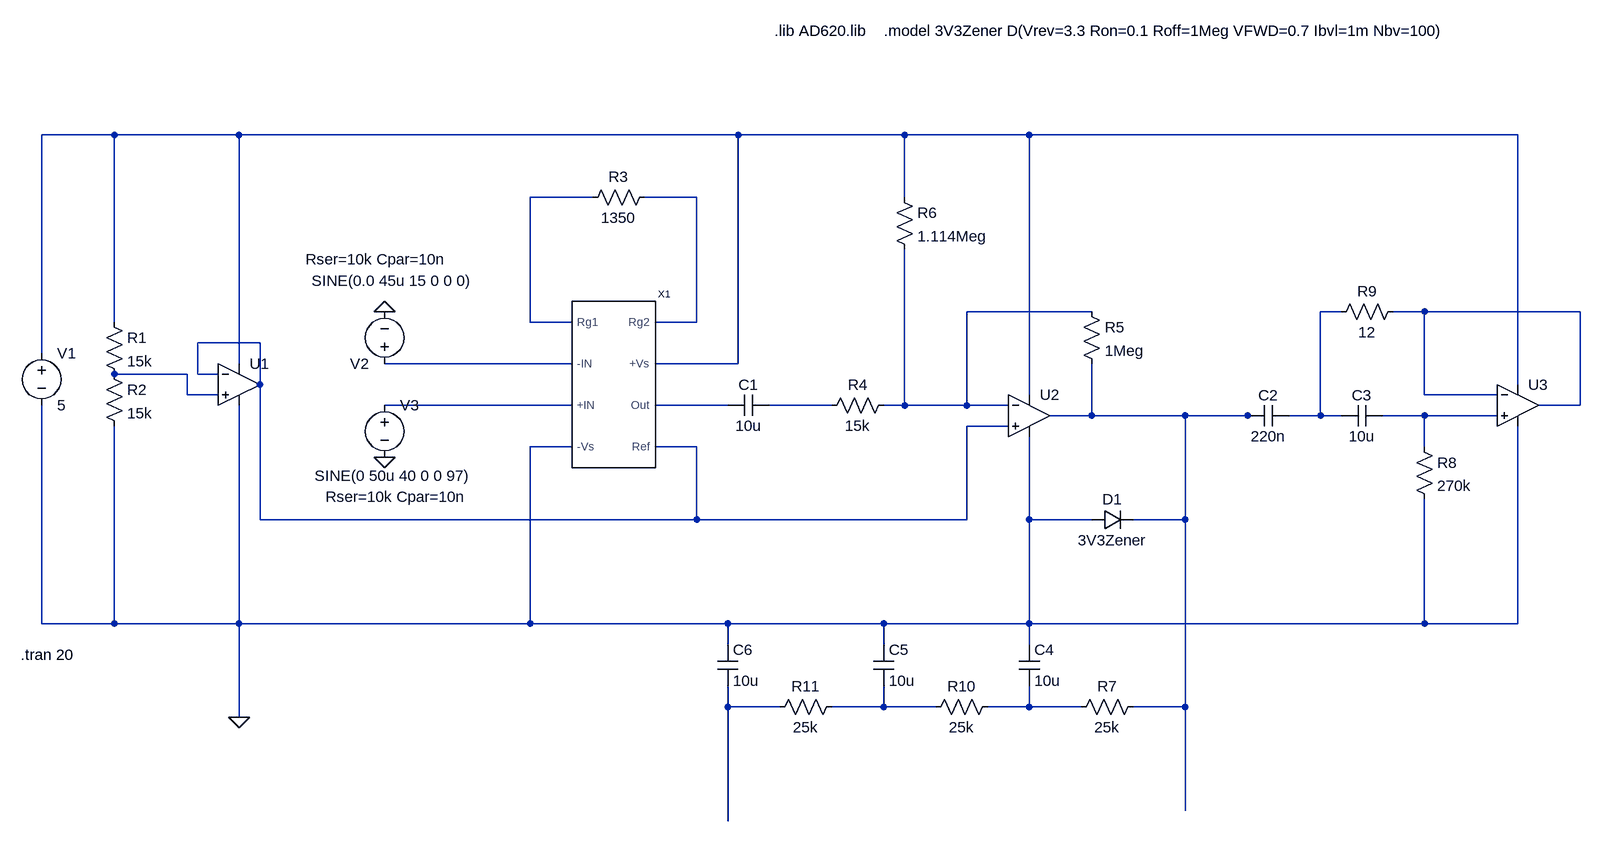
[diagram p0: schematic EEG_Differential_Into_ADC_For_Full_Scale_Range.asc]
EEG_Differential_Into_ADC_For_Full_Scale_Range.asc, the LTspice schematic file:
Version 4.1
SHEET 1 2612 820
WIRE 48 -240 -64 -240
WIRE 240 -240 48 -240
WIRE 1008 -240 240 -240
WIRE 1264 -240 1008 -240
WIRE 1456 -240 1264 -240
WIRE 2208 -240 1456 -240
WIRE 784 -144 688 -144
WIRE 944 -144 864 -144
WIRE 1264 -144 1264 -240
WIRE 1552 32 1360 32
WIRE 1936 32 1904 32
WIRE 2064 32 2016 32
WIRE 2304 32 2064 32
WIRE 48 48 48 -240
WIRE 688 48 688 -144
WIRE 752 48 688 48
WIRE 944 48 944 -144
WIRE 944 48 880 48
WIRE 272 80 176 80
WIRE -64 96 -64 -240
WIRE 240 112 240 -240
WIRE 752 112 464 112
WIRE 1008 112 1008 -240
WIRE 1008 112 880 112
WIRE 160 128 48 128
WIRE 176 128 176 80
WIRE 208 128 176 128
WIRE 272 144 272 80
WIRE 2208 144 2208 -240
WIRE 160 160 160 128
WIRE 208 160 160 160
WIRE 1456 160 1456 -240
WIRE 2064 160 2064 32
WIRE 2176 160 2064 160
WIRE 752 176 464 176
WIRE 992 176 880 176
WIRE 1152 176 1056 176
WIRE 1264 176 1264 -64
WIRE 1264 176 1232 176
WIRE 1360 176 1360 32
WIRE 1360 176 1264 176
WIRE 1424 176 1360 176
WIRE 2304 176 2304 32
WIRE 2304 176 2240 176
WIRE 1552 192 1552 112
WIRE 1552 192 1488 192
WIRE 1696 192 1552 192
WIRE 1792 192 1696 192
WIRE 1808 192 1792 192
WIRE 1904 192 1904 32
WIRE 1904 192 1856 192
WIRE 1936 192 1904 192
WIRE 2064 192 2000 192
WIRE 2176 192 2064 192
WIRE 1424 208 1360 208
WIRE 752 240 688 240
WIRE 944 240 880 240
WIRE 2064 240 2064 192
WIRE 272 352 272 144
WIRE 944 352 944 240
WIRE 944 352 272 352
WIRE 1360 352 1360 208
WIRE 1360 352 944 352
WIRE 1456 352 1456 224
WIRE 1552 352 1456 352
WIRE 1696 352 1696 192
WIRE 1696 352 1616 352
WIRE -64 512 -64 176
WIRE 48 512 48 208
WIRE 48 512 -64 512
WIRE 240 512 240 176
WIRE 240 512 48 512
WIRE 688 512 688 240
WIRE 688 512 240 512
WIRE 992 512 688 512
WIRE 1232 512 992 512
WIRE 1456 512 1456 352
WIRE 1456 512 1232 512
WIRE 2064 512 2064 320
WIRE 2064 512 1456 512
WIRE 2208 512 2208 208
WIRE 2208 512 2064 512
WIRE 992 544 992 512
WIRE 1232 544 1232 512
WIRE 1456 544 1456 512
WIRE 992 640 992 608
WIRE 1072 640 992 640
WIRE 1232 640 1232 608
WIRE 1232 640 1152 640
WIRE 1312 640 1232 640
WIRE 1456 640 1456 608
WIRE 1456 640 1392 640
WIRE 1536 640 1456 640
WIRE 1696 640 1696 352
WIRE 1696 640 1616 640
WIRE 240 656 240 512
WIRE 1696 800 1696 640
WIRE 992 816 992 640
FLAG 464 32 0
FLAG 464 256 0
FLAG 240 656 0
SYMBOL res 32 32 R0
SYMATTR InstName R1
SYMATTR Value 15k
SYMBOL res 32 112 R0
SYMATTR InstName R2
SYMATTR Value 15k
SYMBOL OpAmps\\UniversalOpAmp 240 144 R0
SYMATTR InstName U1
SYMBOL voltage -64 80 R0
WINDOW 123 0 0 Left 0
WINDOW 39 24 124 Left 2
SYMATTR InstName V1
SYMATTR Value 5
SYMBOL res 880 -160 R90
WINDOW 0 0 56 VBottom 2
WINDOW 3 32 56 VTop 2
SYMATTR InstName R3
SYMATTR Value 1350
SYMBOL res 1248 160 R90
WINDOW 0 0 56 VBottom 2
WINDOW 3 32 56 VTop 2
SYMATTR InstName R4
SYMATTR Value 15k
SYMBOL OpAmps\\UniversalOpAmp 1456 192 R0
SYMATTR InstName U2
SYMBOL res 1536 16 R0
SYMATTR InstName R5
SYMATTR Value 1Meg
SYMBOL lib\\sym\\Opamps\\AD620 816 144 R0
SYMATTR InstName X1
SYMATTR Prefix X
SYMATTR SpiceModel AD620
SYMBOL cap 1856 176 R90
WINDOW 0 0 32 VBottom 2
WINDOW 3 32 32 VTop 2
SYMATTR InstName C2
SYMATTR Value 220n
SYMBOL cap 2000 176 R90
WINDOW 0 0 32 VBottom 2
WINDOW 3 32 32 VTop 2
SYMATTR InstName C3
SYMATTR Value 10u
SYMBOL res 2048 224 R0
SYMATTR InstName R8
SYMATTR Value 270k
SYMBOL res 2032 16 R90
WINDOW 0 0 56 VBottom 2
WINDOW 3 32 56 VTop 2
SYMATTR InstName R9
SYMATTR Value 12
SYMBOL OpAmps\\UniversalOpAmp 2208 176 R0
SYMATTR InstName U3
SYMBOL voltage 464 128 R180
WINDOW 3 -135 144 Left 2
WINDOW 123 0 0 Left 0
WINDOW 39 -97 177 Left 2
SYMATTR Value SINE(0.0 45u 15 0 0 0)
SYMATTR SpiceLine Rser=10k Cpar=10n
SYMATTR InstName V2
SYMBOL voltage 464 160 R0
WINDOW 3 -108 124 Left 2
WINDOW 123 0 0 Left 0
WINDOW 39 -91 157 Left 2
SYMATTR Value SINE(0 50u 40 0 0 97)
SYMATTR SpiceLine Rser=10k Cpar=10n
SYMATTR InstName V3
SYMBOL cap 1056 160 R90
WINDOW 0 0 32 VBottom 2
WINDOW 3 32 32 VTop 2
SYMATTR InstName C1
SYMATTR Value 10u
SYMBOL res 1248 -160 R0
SYMATTR InstName R6
SYMATTR Value 1.114Meg
SYMBOL res 1632 624 R90
WINDOW 0 0 56 VBottom 2
WINDOW 3 32 56 VTop 2
SYMATTR InstName R7
SYMATTR Value 25k
SYMBOL cap 1440 544 R0
SYMATTR InstName C4
SYMATTR Value 10u
SYMBOL diode 1552 368 R270
WINDOW 0 32 32 VTop 2
WINDOW 3 0 32 VBottom 2
SYMATTR InstName D1
SYMATTR Value 3V3Zener
SYMBOL cap 1216 544 R0
SYMATTR InstName C5
SYMATTR Value 10u
SYMBOL res 1408 624 R90
WINDOW 0 0 56 VBottom 2
WINDOW 3 32 56 VTop 2
SYMATTR InstName R10
SYMATTR Value 25k
SYMBOL res 1168 624 R90
WINDOW 0 0 56 VBottom 2
WINDOW 3 32 56 VTop 2
SYMATTR InstName R11
SYMATTR Value 25k
SYMBOL cap 976 544 R0
SYMATTR InstName C6
SYMATTR Value 10u
TEXT 1064 -400 Left 2 !.lib AD620.lib
TEXT -96 560 Left 2 !.tran 20
TEXT 1232 -400 Left 2 !.model 3V3Zener D(Vrev=3.3 Ron=0.1 Roff=1Meg VFWD=0.7 Ibvl=1m Nbv=100)

The netlist it stands for:
* EEG_Differential_Into_ADC_For_Full_Scale_Range.asc
R1 N001 N009 15k
R2 N009 0 15k
X§U1 N009 N007 N001 0 N007 level1 Avol=1Meg GBW=10Meg Vos=0 En=0 Enk=0 In=0 Ink=0 Rin=500Meg  ; pins In+ In- V+ V- OUT
V1 N001 0 5
R3 N003 N002 1350
R4 N004 N012 15k
X§U2 N007 N004 N001 0 N013 level1 Avol=1Meg GBW=10Meg Vos=0 En=0 Enk=0 In=0 Ink=0 Rin=500Meg  ; pins In+ In- V+ V- OUT
R5 N004 N013 1Meg
X§X1 N010 N008 N001 0 N011 N007 N002 N003 AD620  ; pins +IN -IN +Vs -Vs Out Ref Rg1 Rg2
C2 N005 N013 220n
C3 N014 N005 10u
R8 N014 0 270k
R9 N006 N005 12
X§U3 N014 N006 N001 0 N006 level1 Avol=1Meg GBW=10Meg Vos=0 En=0 Enk=0 In=0 Ink=0 Rin=500Meg  ; pins In+ In- V+ V- OUT
V2 N008 0 SINE(0.0 45u 15 0 0 0) Rser=10k Cpar=10n
V3 N010 0 SINE(0 50u 40 0 0 97) Rser=10k Cpar=10n
C1 N012 N011 10u
R6 N001 N004 1.114Meg
R7 N013 N017 25k
C4 0 N017 10u
D1 0 N013 3V3Zener
C5 0 N016 10u
R10 N017 N016 25k
R11 N016 N015 25k
C6 0 N015 10u
.model D D
.lib standard.dio
.lib AD620.lib
.tran 20
.model 3V3Zener D(Vrev=3.3 Ron=0.1 Roff=1Meg VFWD=0.7 Ibvl=1m Nbv=100)
.lib UniversalOpAmp1.lib
.backanno
.end